# EAGLE design MOM-analog-ins_one-layer_v08 (EAGLE 8.2.0)
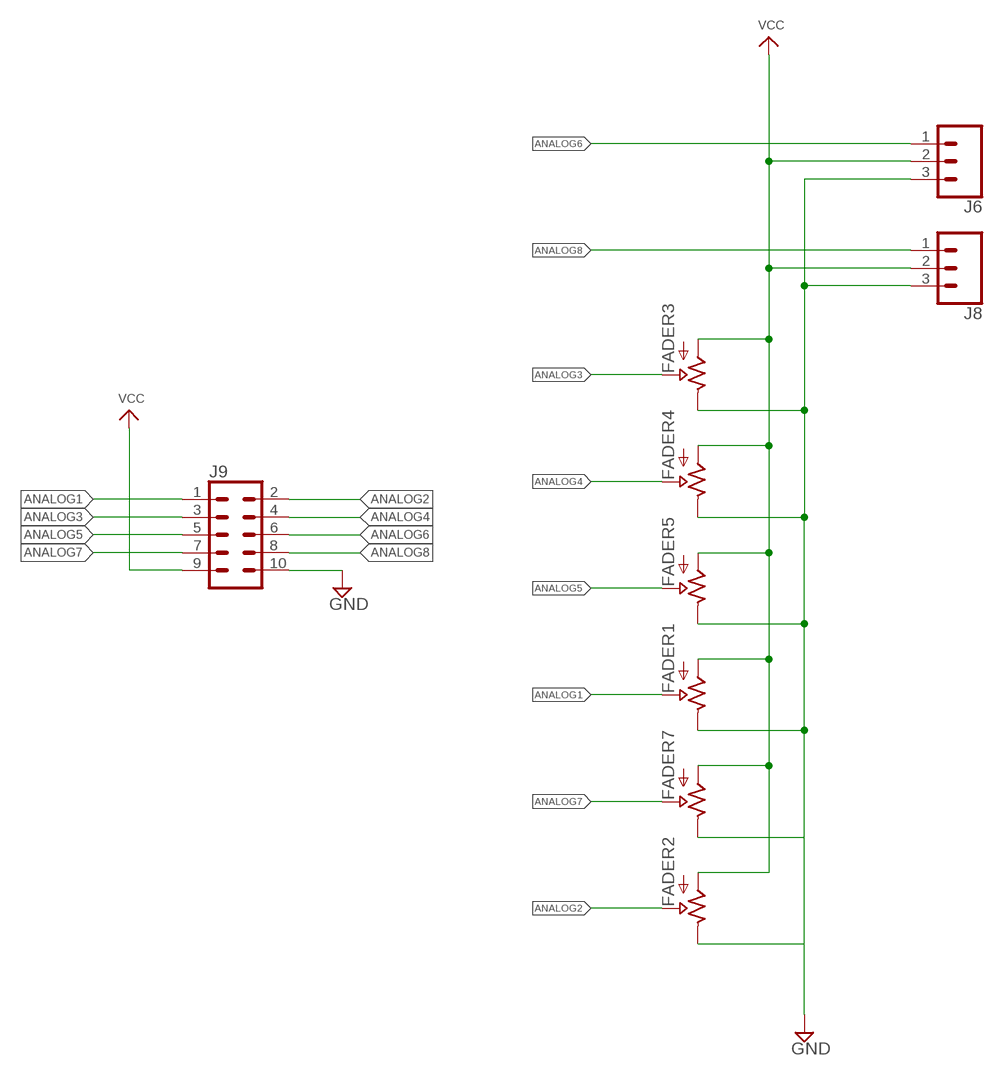
[diagram p0: schematic, sheet 1]

## Parts
FADER1  POTTRIMPOT-DIGIKEY  [TRIMPOT-DIGIKEY]
FADER2  POTTRIMPOT-DIGIKEY  [TRIMPOT-DIGIKEY]
FADER3  POTTRIMPOT-DIGIKEY  [TRIMPOT-DIGIKEY]
FADER4  POTTRIMPOT-DIGIKEY  [TRIMPOT-DIGIKEY]
FADER5  POTTRIMPOT-DIGIKEY  [TRIMPOT-DIGIKEY]
FADER7  POTTRIMPOT-DIGIKEY  [TRIMPOT-DIGIKEY]
J6  CONN_03LOCK  [1X03_LOCK]
J8  CONN_03LOCK  [1X03_LOCK]
J9  CONN_05X2SHD_LOCK  [2X5-SHROUDED_LOCK]

## Nets
ANALOG1: FADER1.2(WIPER) J9.1
ANALOG2: FADER2.2(WIPER) J9.2
ANALOG3: FADER3.2(WIPER) J9.3
ANALOG4: FADER4.2(WIPER) J9.4
ANALOG5: FADER5.2(WIPER) J9.5
ANALOG6: J6.1 J9.6
ANALOG7: FADER7.2(WIPER) J9.7
ANALOG8: J8.1 J9.8
GND: FADER1.3(OUT) FADER2.3(OUT) FADER3.3(OUT) FADER4.3(OUT) FADER5.3(OUT) FADER7.3(OUT) J6.3 J8.3 J9.10
VCC: FADER1.1(IN) FADER2.1(IN) FADER3.1(IN) FADER4.1(IN) FADER5.1(IN) FADER7.1(IN) J6.2 J8.2 J9.9

## Library data of the parts
FADER1-FADER5 FADER7 = CMU-ArtFab:POT
J6 J8 = SparkFun-Connectors:CONN_03: Multi connection point. Often used as Generic Header-pin footprint for 0.1 inch spaced/style header connections On any of the 0.1 inch spaced packages, you can populate with these: Break Away Headers - Straight <https://www.sparkfun.com/products/116> (PRT-00116) Break Away Male Headers - Right Angle <https://www.sparkfun.com/products/553> (PRT-00553) Female Headers <https://www.sparkfun.com/products/115> (PRT-00115) Break Away Headers - Machine Pin <https://www.sparkfun.com/products/117> (PRT-00117) Break Away Female Headers - Swiss Machine Pin <https://www.sparkfun.com/products/743> (PRT-00743) Stackable Header - 3 Pin (Female, 0.1") <https://www.sparkfun.com/products/13875> (PRT-13875) For SCREWTERMINALS and SPRING TERMINALS visit here: Screw Terimnals on SparkFun.com <https://www.sparkfun.com/search/results?term=Screw+Terminals> (5mm/3.5mm/2.54mm spacing) This device is also useful as a general connection point to wire up your design to another part of your project. Our various solder wires solder well into these plated through hole pads. Hook-Up Wire - Assortment (Stranded, 22 AWG) <https://www.sparkfun.com/products/11375> (PRT-11375) Hook-Up Wire - Assortment (Solid Core, 22 AWG) <https://www.sparkfun.com/products/11367> (PRT-11367) View the entire wire category on our website here <https://www.sparkfun.com/categories/141> Special notes: Molex polarized connector foot print use with SKU : PRT-08232 with associated crimp pins and housings.
J9 = SparkFun-Connectors:CONN_05X2: Multi connection point. Often used as Generic Header-pin footprint for 0.1 inch spaced/style header connections For AVR SPI programming port, see special device with nice symbol: "AVR_SPI_PROG_5x2.dev" You can populate with any combo of single row headers, but if you'd like an exact match, check these: 2x5 AVR ICSP Male Header <https://www.sparkfun.com/products/778> (PRT-00778) 2x5 Pin Shrouded Header <https://www.sparkfun.com/products/8506> (PRT-08506) On any of the 0.1 inch spaced packages, you can populate with these: Break Away Headers - Straight <https://www.sparkfun.com/products/116> (PRT-00116) Break Away Male Headers - Right Angle <https://www.sparkfun.com/products/553> (PRT-00553) Female Headers <https://www.sparkfun.com/products/115> (PRT-00115) Break Away Headers - Machine Pin <https://www.sparkfun.com/products/117> (PRT-00117) Break Away Female Headers - Swiss Machine Pin <https://www.sparkfun.com/products/743> (PRT-00743) Special note: the shrouded connector mates well with our 5x2 ribbon cables: 2x5 Pin IDC Ribbon Cable <https://www.sparkfun.com/products/8535> (PRT-08535); PROD_ID: CONN-08671; SF_ID: PRT-08506

## Net classes
0 default: width 0.254 mm, clearance 0.152 mm

## Board
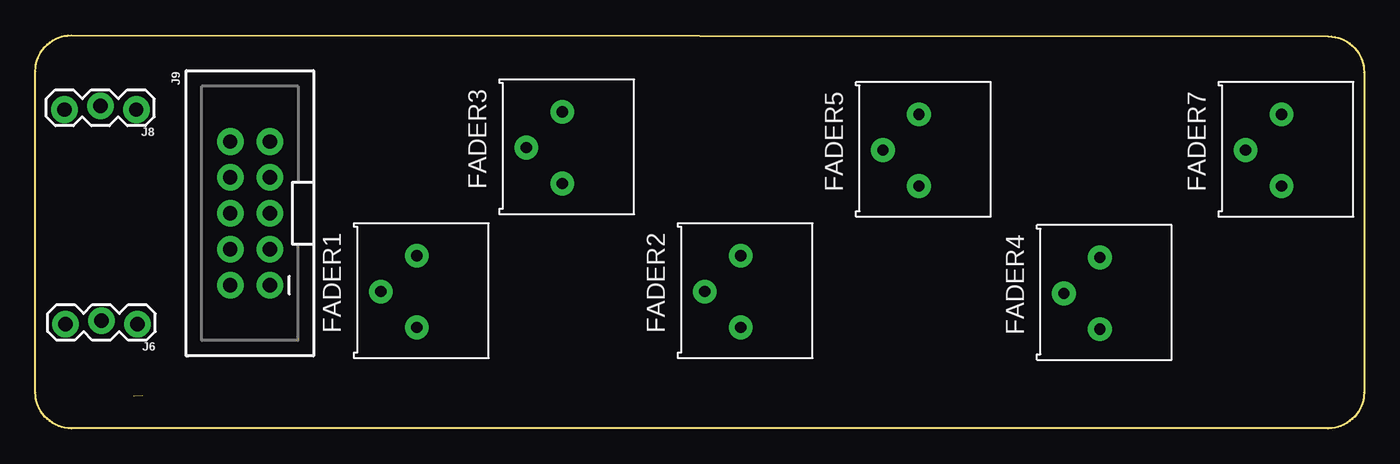
[diagram p1: board, top side]
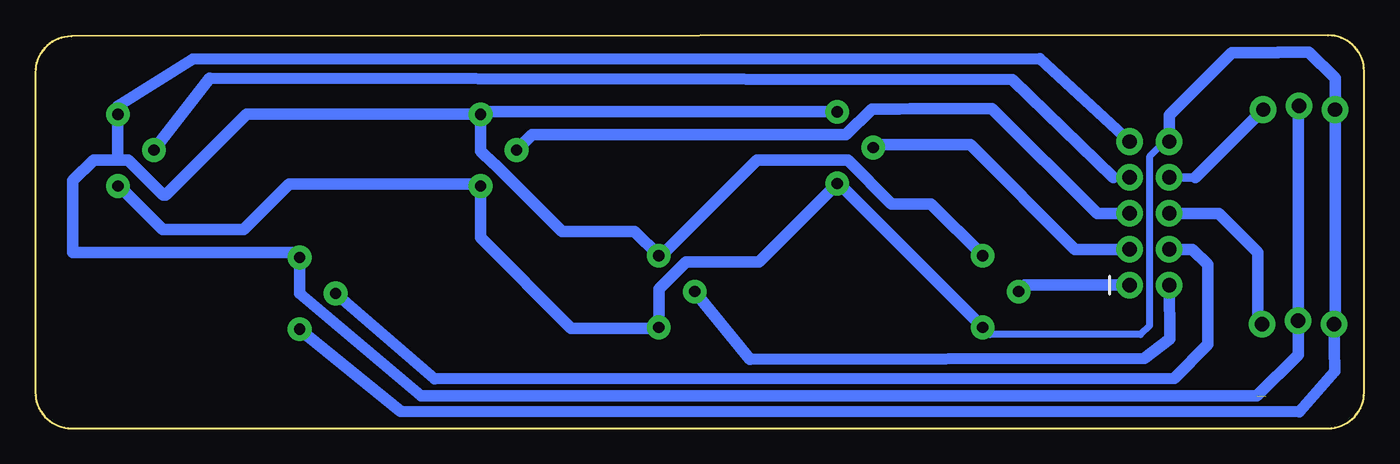
[diagram p2: board, bottom side, seen from below]

Size 93.98 x 27.81 mm. Coordinates in mm from the lower left corner, seen from the top.
Outline: 0,2.54 0,25.27 arc-90 2.54,27.81 91.44,27.74 arc-90 93.98,25.2 93.98,2.54 arc-90 91.44,0 2.54,0 arc-90 0,2.54
Copper layers (1*16): Top 0.035mm / dielectric 1.5mm / Bottom 0.035mm
Design rules "default *": minimum track width 24mil, minimum drill 24mil, track to track 20mil, track to pad 12mil, pad to pad 8mil, via to via 8mil, smd to smd 8mil, copper to edge 40mil, drill to drill 8mil, minimum pad ring 10mil, minimum via ring 8mil, stop-mask expansion 4mil, vias tented up to drill 0mil, thermal gap 10mil

### Footprints (pad centres in the part's own frame; a part is rotated, then mirrored left to right if it is on the bottom)
TRIMPOT-DIGIKEY = drill 0.794 pad 1.676: 1 2.54,-2.54; 2 0,0; 3 -2.54,-2.54
1X03_LOCK = drill 1.016 pad 1.88: 1 0,0.127; 2 2.54,-0.127; 3 5.08,0.127
2X5-SHROUDED_LOCK = drill 1.016 pad 1.88: 1 -1.397,5.08; 2 1.397,5.08; 3 -1.397,2.54; 4 1.397,2.54; 5 -1.397,0; 6 1.397,0; 7 -1.397,-2.54; 8 1.397,-2.54; 9 -1.397,-5.08; 10 1.397,-5.08

### Placement (x,y rotation side)
FADER1  24.43,9.68 90 top
FADER2  47.35,9.68 90 top
FADER3  34.72,19.86 90 top
FADER4  72.75,9.55 90 top
FADER5  59.94,19.68 90 top
FADER7  85.6,19.68 90 top
J6  7.21,7.49 180 top
J8  7.14,22.68 180 top
J9  15.18,15.21 180 top

### Tracks (layer width: path | path; a pad name or v marks a point on that pad's centre or on a via)
ANALOG1
  Bottom 0.813: J9.1 23.98,10.13 FADER1.2
ANALOG2
  Bottom 0.813: J9.2 13.76,6.33 15.54,4.95 43.43,4.88 FADER2.2
ANALOG3
  Bottom 0.61: 34.52,20.07 FADER3.2
  Bottom 0.813: J9.3 20.45,12.67 27.84,20.07 34.52,20.07
ANALOG4
  Bottom 0.813: J9.4 12.16,12.67 11.07,11.58 11.07,5.94 13.44,3.53 65.73,3.5 FADER4.2
ANALOG5
  Bottom 0.813: J9.5 18.86,15.21 26.33,22.63 32.08,22.63 32.92,22.61 34.82,22.61 36.65,20.78 58.85,20.78 FADER5.2
ANALOG6
  Bottom 0.61: 7.52,7.67 J6.1
  Bottom 0.813: J9.6 10.29,15.21 7.52,12.45 7.52,7.67
ANALOG7
  Bottom 0.61: J9.7 17.73,17.75
  Bottom 0.813: 17.73,17.75 24.89,24.69 81.66,24.79 FADER7.2
ANALOG8
  Bottom 0.61: J9.8 11.94,17.75
  Bottom 0.813: 11.94,17.75 J8.1
GND
  Bottom 0.508: 14.12,20.29 15.19,19.23 15.19,7.26 15.82,6.63 26.47,6.63 FADER1.3
  Bottom 0.61: 2.06,7.44 J6.3 | FADER3.3 37.16,17.32 | FADER5.3 62.48,16.56 63.2,17.27 | 49.94,7.09 FADER2.3 | FADER7.3 88.06,17.14 | J9.10 14.12,20.29 | 6.07,26.62 6.1,26.59
  Bottom 0.813: J9.10 13.78,22.16 9.35,26.59 6.1,26.59 | 2.06,7.44 J8.3 2.06,24.77 3.91,26.62 6.07,26.62 | J6.3 2.08,4.04 4.57,1.17 68.15,1.19 FADER4.3 | FADER2.3 49.89,9.86 47.95,11.79 42.8,11.79 FADER3.3 | FADER1.3 37.16,17.32 | 62.48,16.56 62.48,13.49 56.08,7.09 49.94,7.09 | 88.06,17.14 84.99,14.07 79.25,14.07 76.05,17.27 63.2,17.27
VCC  (1 unrouted)
  Bottom 0.61: FADER3.1 37.64,22.02 | 62.31,22.4 FADER5.1 | 61.54,18.69 61.52,18.69 | FADER2.1 49.71,12.22 | 4.67,22.73 J8.2 | 84.76,16.51 84.94,16.51 | 75.64,12.45 FADER4.1 | 88.14,22.81 FADER7.1 88.14,22.2 | 88.14,19.02 88.11,19
  Bottom 0.813: FADER3.1 62.31,22.4 | 61.54,18.69 62.48,19.63 FADER5.1 79.05,22.23 84.76,16.51 | 61.52,18.69 56.74,13.92 51.59,13.92 FADER2.1 | 49.71,12.22 42.95,18.97 36.52,18.97 33.43,15.88 30.63,15.88 FADER1.1 | FADER4.1 75.29,9.55 66.7,2.29 7.59,2.29 4.67,5.21 J6.2 4.67,22.73 | 84.94,16.51 87.43,19 88.11,19 89.86,19 91.34,17.53 91.34,12.45 75.64,12.45 | 88.14,22.81 82.86,26.14 22.93,26.16 J9.9 | FADER7.1 88.14,19.02